# Altium schematic sheet Esquema_ATMEGA328.SchDoc
size A4
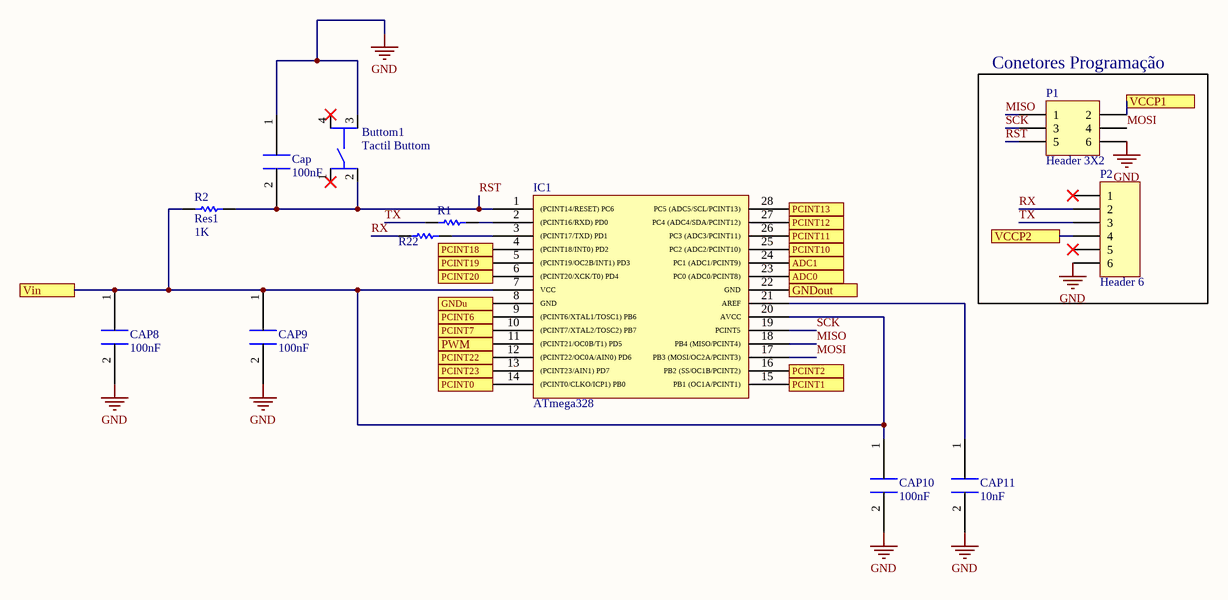
[diagram p0: Esquema_ATMEGA328.SchDoc]

## Parts
Buttom1  Tactil Buttom  [Tactil Buttom]
Cap  100nF  [Capacitor Eletro]
CAP8  100nF  [Capacitor Eletro]
CAP9  100nF  [Capacitor Eletro]
CAP10  100nF  [Capacitor Eletro]
CAP11  10nF  [Capacitor Eletro]
IC1  ATmega328  [ATmega328]
P1  Header 3X2  [HDR2X3]
P2  Header 6  [HDR1X6]
R1  Res1  [AXIAL-0.3]  (value not drawn)
R2  Res1  value 1K  [AXIAL-0.3]
R22  Res1  [AXIAL-0.3]  (value not drawn)

## Blocks framed on the sheet
Conetores Programação: P1 P2

## Ports
ADC0, ADC1, GNDout, GNDu, PCINT0, PCINT1, PCINT2, PCINT6, PCINT7, PCINT10, PCINT11, PCINT12, PCINT13, PCINT18, PCINT19, PCINT20, PCINT22, PCINT23, PWM, VCCP1, VCCP2, Vin

## Nets
GND: Buttom1.3 Cap.1 CAP8.2 CAP9.2 CAP10.2 CAP11.2 P1.6 P2.6
ADC0: IC1.23(PC0_(ADC0/PCINT8)) ; port ADC0
ADC1: IC1.24(PC1_(ADC1/PCINT9)) ; port ADC1
GNDout: IC1.22(GND) ; port GNDout
GNDu: IC1.8(GND) ; port GNDu
MISO: IC1.18(PB4_(MISO/PCINT4)) P1.1
MOSI: IC1.17(PB3_(MOSI/OC2A/PCINT3)) P1.4
PCINT0: IC1.14((PCINT0/CLKO/ICP1)_PB0) ; port PCINT0
PCINT1: IC1.15(PB1_(OC1A/PCINT1)) ; port PCINT1
PCINT2: IC1.16(PB2_(SS/OC1B/PCINT2)) ; port PCINT2
PCINT6: IC1.9((PCINT6/XTAL1/TOSC1)_PB6) ; port PCINT6
PCINT7: IC1.10((PCINT7/XTAL2/TOSC2)_PB7) ; port PCINT7
PCINT10: IC1.25(PC2_(ADC2/PCINT10)) ; port PCINT10
PCINT11: IC1.26(PC3_(ADC3/PCINT11)) ; port PCINT11
PCINT12: IC1.27(PC4_(ADC4/SDA/PCINT12)) ; port PCINT12
PCINT13: IC1.28(PC5_(ADC5/SCL/PCINT13)) ; port PCINT13
PCINT18: IC1.4((PCINT18/INT0)_PD2) ; port PCINT18
PCINT19: IC1.5((PCINT19/OC2B/INT1)_PD3) ; port PCINT19
PCINT20: IC1.6((PCINT20/XCK/T0)_PD4) ; port PCINT20
PCINT22: IC1.12((PCINT22/OC0A/AIN0)_PD6) ; port PCINT22
PCINT23: IC1.13((PCINT23/AIN1)_PD7) ; port PCINT23
PWM: IC1.11((PCINT21/OC0B/T1)_PD5) ; port PWM
RST: Buttom1.2 Cap.2 IC1.1((PCINT14/RESET)_PC6) P1.5 R2.2
RX: P2.2 R22.1
SCK: IC1.19(PCINT5) P1.3
TX: P2.3 R1.1
VCCP1: P1.2 ; port VCCP1
VCCP2: P2.4 ; port VCCP2
Vin: CAP8.1 CAP9.1 CAP10.1 IC1.7(VCC) IC1.20(AVCC) R2.1 ; port Vin
NetCAP11_1: CAP11.1 IC1.21(AREF)
NetIC1_2: IC1.2((PCINT16/RXD)_PD0) R1.2
NetIC1_3: IC1.3((PCINT17/TXD)_PD1) R22.2

Not connected (* = marked no-connect by the designer): Buttom1 1* 4*; P2 1* 5*

## Library data of the parts
Cap CAP8-CAP11 = 33pF: Condensador
P1 = Header 3X2: Header, 3-Pin, Dual row; LatestRevisionDate: 17-Jul-2002; LatestRevisionNote: Re-released for DXP Platform.; Publisher: Altium Limited
P2 = Header 6: Header, 6-Pin; LatestRevisionDate: 17-Jul-2002; LatestRevisionNote: Re-released for DXP Platform.; Publisher: Altium Limited
R1 R22 = Res1: Resistor; Value: 1K; Published: 8-Jun-2000; LatestRevisionDate: 17-Jul-2002; LatestRevisionNote: Re-released for DXP Platform.; PackageReference: AXIAL-0.3; Publisher: Altium Limited; PackageDescription: Axial Device, Thru-Hole; 2 Leads; 0.3 in Pin Spacing
R2 = Res1: Resistor; Published: 8-Jun-2000; LatestRevisionDate: 17-Jul-2002; LatestRevisionNote: Re-released for DXP Platform.; PackageReference: AXIAL-0.3; Publisher: Altium Limited; PackageDescription: Axial Device, Thru-Hole; 2 Leads; 0.3 in Pin Spacing